# EAGLE design DualLoopingARFG (EAGLE 9.6.0)
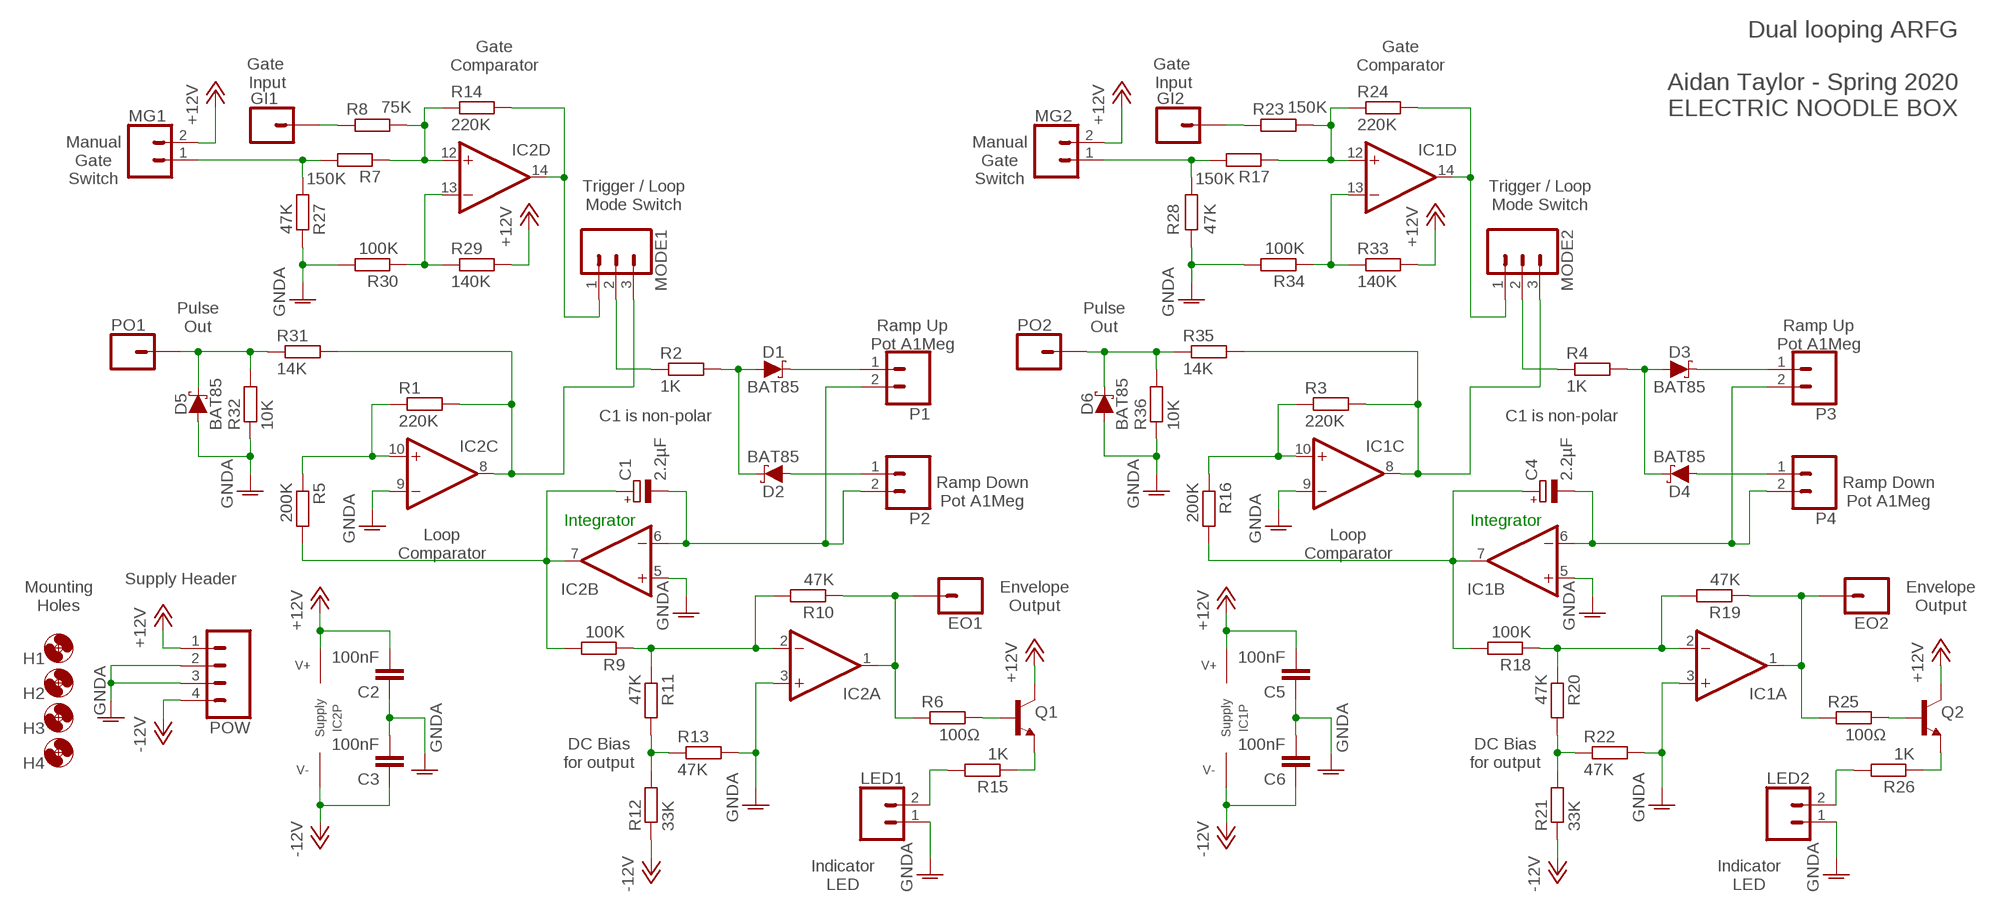
[diagram p0: schematic, sheet 1]

## Parts
C1  2.2µF  CPOL-EUE2-5  [E2-5]
C2  100nF  C-EU050-025X075  [C050-025X075]
C3  100nF  C-EU050-025X075  [C050-025X075]
C4  2.2µF  CPOL-EUE2-5  [E2-5]
C5  100nF  C-EU050-025X075  [C050-025X075]
C6  100nF  C-EU050-025X075  [C050-025X075]
D1  BAT85  SCHOTTKY_DO35  [DO35-7]
D2  BAT85  SCHOTTKY_DO35  [DO35-7]
D3  BAT85  SCHOTTKY_DO35  [DO35-7]
D4  BAT85  SCHOTTKY_DO35  [DO35-7]
D5  BAT85  SCHOTTKY_DO35  [DO35-7]
D6  BAT85  SCHOTTKY_DO35  [DO35-7]
EO1  1XWIREPAD  [1X01]
EO2  1XWIREPAD  [1X01]
GI1  1XWIREPAD  [1X01]
GI2  1XWIREPAD  [1X01]
H1  MOUNT-HOLE3.2  [3,2]
H2  MOUNT-HOLE3.2  [3,2]
H3  MOUNT-HOLE3.2  [3,2]
H4  MOUNT-HOLE3.2  [3,2]
IC1  TL0X4DIL  [DIL14]
IC2  TL0X4DIL  [DIL14]
LED1  2XWIREPAD  [1X02]
LED2  2XWIREPAD  [1X02]
MG1  2XWIREPAD  [1X02]
MG2  2XWIREPAD  [1X02]
MODE1  3XWIREPAD  [1X03]
MODE2  3XWIREPAD  [1X03]
P1  2XWIREPAD  [1X02]
P2  2XWIREPAD  [1X02]
P3  2XWIREPAD  [1X02]
P4  2XWIREPAD  [1X02]
PO1  1XWIREPAD  [1X01]
PO2  1XWIREPAD  [1X01]
POW  4XMOLEX  [MOLEX-1X4]
Q1  2N3904  [TO92]
Q2  2N3904  [TO92]
R1  220K  R-EU_0207/10  [0207/10]
R2  1K  R-EU_0207/10  [0207/10]
R3  220K  R-EU_0207/10  [0207/10]
R4  1K  R-EU_0207/10  [0207/10]
R5  200K  R-EU_0207/10  [0207/10]
R6  100Ω  R-EU_0207/10  [0207/10]
R7  150K  R-EU_0207/10  [0207/10]
R8  75K  R-EU_0207/10  [0207/10]
R9  100K  R-EU_0207/10  [0207/10]
R10  47K  R-EU_0207/10  [0207/10]
R11  47K  R-EU_0207/10  [0207/10]
R12  33K  R-EU_0207/10  [0207/10]
R13  47K  R-EU_0207/10  [0207/10]
R14  220K  R-EU_0207/10  [0207/10]
R15  1K  R-EU_0207/10  [0207/10]
R16  200K  R-EU_0207/10  [0207/10]
R17  150K  R-EU_0207/10  [0207/10]
R18  100K  R-EU_0207/10  [0207/10]
R19  47K  R-EU_0207/10  [0207/10]
R20  47K  R-EU_0207/10  [0207/10]
R21  33K  R-EU_0207/10  [0207/10]
R22  47K  R-EU_0207/10  [0207/10]
R23  150K  R-EU_0207/10  [0207/10]
R24  220K  R-EU_0207/10  [0207/10]
R25  100Ω  R-EU_0207/10  [0207/10]
R26  1K  R-EU_0207/10  [0207/10]
R27  47K  R-EU_0207/10  [0207/10]
R28  47K  R-EU_0207/10  [0207/10]
R29  140K  R-EU_0207/10  [0207/10]
R30  100K  R-EU_0207/10  [0207/10]
R31  14K  R-EU_0207/10  [0207/10]
R32  10K  R-EU_0207/10  [0207/10]
R33  140K  R-EU_0207/10  [0207/10]
R34  100K  R-EU_0207/10  [0207/10]
R35  14K  R-EU_0207/10  [0207/10]
R36  10K  R-EU_0207/10  [0207/10]

## Nets
+12V: C2.2 C5.2 IC1.4(P:V+) IC2.4(P:V+) MG1.2 MG2.2 POW.1 Q1.1(C) Q2.1(C) R29.2 R33.2
-12V: C3.1 C6.1 IC1.11(P:V-) IC2.11(P:V-) POW.4 R12.1 R21.1
ENV1_TRIG: GI1.1 R8.1
ENV1_TRIG1: GI2.1 R23.1
ENVELOPE_OUTPUT: EO1.1 IC2.1(A:OUT) R6.1 R10.1
ENVELOPE_OUTPUT1: EO2.1 IC1.1(A:OUT) R19.1 R25.1
GNDA: C2.1 C3.2 C5.1 C6.2 D5.A D6.A IC1.3(A:+IN) IC1.5(B:+IN) IC1.9(C:-IN) IC2.3(A:+IN) IC2.5(B:+IN) IC2.9(C:-IN) LED1.1 LED2.1 POW.2 POW.3 R13.2 R22.2 R27.2 R28.2 R30.2 R32.1 R34.2 R36.1
N$1: IC2.8(C:OUT) MODE1.3 R1.2 R31.2
N$2: D1.A D2.C R2.2
N$3: D1.C P1.1
N$4: D2.A P2.1
N$5: C1.- IC2.6(B:-IN) P1.2 P2.2
N$6: Q1.2(B) R6.2
N$7: C1.+ IC2.7(B:OUT) R5.2 R9.2
N$8: IC2.10(C:+IN) R1.1 R5.1
N$9: IC2.2(A:-IN) R9.1 R10.2 R11.1
N$10: Q1.3(E) R15.1
N$11: R11.2 R12.2 R13.1
N$12: MG1.1 R7.2 R27.1
N$13: IC2.12(D:+IN) R7.1 R8.2 R14.1
N$14: MODE1.2 R2.1
N$15: IC2.14(D:OUT) MODE1.1 R14.2
N$16: LED1.2 R15.2
N$17: IC1.8(C:OUT) MODE2.3 R3.2 R35.2
N$18: D3.A D4.C R4.2
N$19: D4.A P4.1
N$20: C4.- IC1.6(B:-IN) P3.2 P4.2
N$21: C4.+ IC1.7(B:OUT) R16.2 R18.2
N$22: IC1.10(C:+IN) R3.1 R16.1
N$23: IC1.2(A:-IN) R18.1 R19.2 R20.1
N$24: R20.2 R21.2 R22.1
N$25: MG2.1 R17.2 R28.1
N$26: IC1.12(D:+IN) R17.1 R23.2 R24.1
N$27: IC1.14(D:OUT) MODE2.1 R24.2
N$28: MODE2.2 R4.1
N$29: Q2.2(B) R25.2
N$30: Q2.3(E) R26.1
N$31: LED2.2 R26.2
N$32: D3.C P3.1
N$33: IC2.13(D:-IN) R29.1 R30.1
N$34: D5.C PO1.1 R31.1 R32.2
N$35: IC1.13(D:-IN) R33.1 R34.1
N$36: D6.C PO2.1 R35.1 R36.2

## Notes on the sheet
- Dual looping ARFG
  
  Aidan Taylor - Spring 2020
  ELECTRIC NOODLE BOX
- Gate
  Comparator
- Gate
  Comparator
- Gate 
  Input
- Gate 
  Input
- Manual
  Gate
  Switch
- Manual
  Gate
  Switch
- Trigger / Loop
  Mode Switch
- Trigger / Loop
  Mode Switch
- Pulse
  Out
- Pulse
  Out
- Ramp Up
  Pot A1Meg
- Ramp Up
  Pot A1Meg
- C1 is non-polar | C1 is non-polar
- Ramp Down
  Pot A1Meg
- Ramp Down
  Pot A1Meg
- Integrator | Integrator
- Loop
  Comparator
- Loop
  Comparator
- Supply Header
- Mounting
  Holes
- Envelope
  Output
- Envelope
  Output
- DC Bias
  for output
- DC Bias
  for output
- Indicator
  LED
- Indicator
  LED

## Library data of the parts
C1 C4 = rcl:CPOL-EU: POLARIZED CAPACITOR, European symbol; SPICEPREFIX: C
C2 C3 C5 C6 = rcl:C-EU: CAPACITOR, European symbol; SPICEPREFIX: C
D1-D6 = ElectricNoodleBox:SCHOTTKY_DO35
EO1 EO2 GI1 GI2 PO1 PO2 = ElectricNoodleBox:1XWIREPAD
H1-H4 = holes:MOUNT-HOLE: MOUNTING HOLE with drill center marker
IC1 IC2 = ElectricNoodleBox:TL0X4
LED1 LED2 MG1 MG2 P1-P4 = ElectricNoodleBox:2XWIREPAD
MODE1 MODE2 = ElectricNoodleBox:3XWIREPAD
POW = ElectricNoodleBox:4XMOLEX; SPICEPREFIX: E
Q1 Q2 = transistor:2N3904: NPN TRANSISTOR
R1-R36 = rcl:R-EU_: RESISTOR, European symbol; SPICEPREFIX: R

## Board
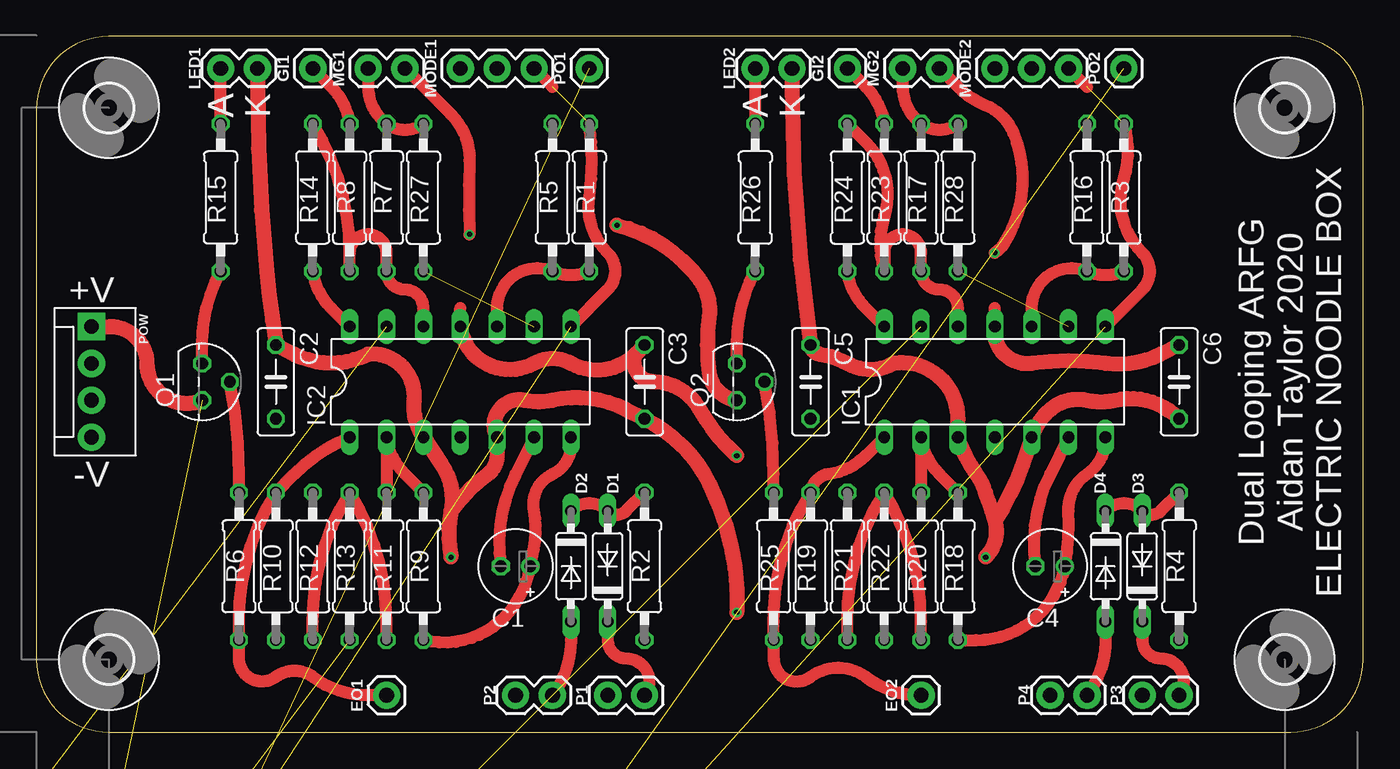
[diagram p1: board, top side]
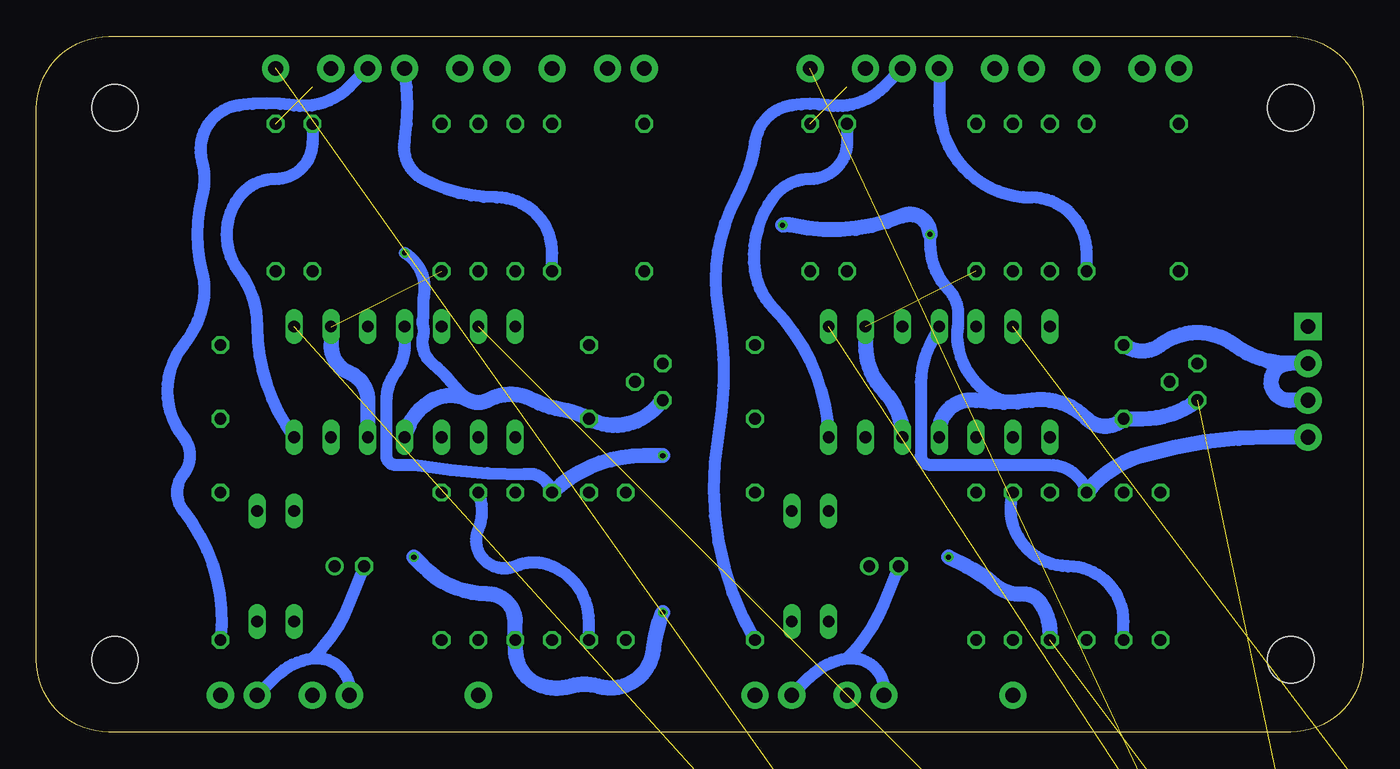
[diagram p2: board, bottom side, seen from below]

Size 91.42 x 47.93 mm. Coordinates in mm from the lower left corner, seen from the top.
Outline: 0,42.93 0,5 arc90 5,0 86.42,0 arc90 91.42,5 91.42,42.93 arc90 86.42,47.93 5,47.93 arc90 0,42.93
Copper layers (1*16): Top 0.035mm / dielectric 1.6mm / Bottom 0.035mm
Design rules "Elecrow_2-layer_PCB_eagle_rule": minimum track width 6mil, minimum drill 12mil, track to track 6mil, track to pad 6mil, pad to pad 6mil, via to via 8mil, smd to smd 0mil, copper to edge 20mil, drill to drill 10mil, minimum pad ring 6mil, minimum via ring 6mil, stop-mask expansion 0mil, vias tented up to drill 100mil, thermal gap 10mil

### Footprints (pad centres in the part's own frame; a part is rotated, then mirrored left to right if it is on the bottom)
E2-5 = drill 0.813 pad 1.27: + -1.016,0 | drill 0.813 pad 1.27 octagon: - 1.016,0
C050-025X075 = drill 0.813 octagon: 1 -2.54,0; 2 2.54,0
DO35-7 = drill 0.813 long: A 3.81,0; C -3.81,0
1X01 = drill 1.016 pad 1.88: 1 0,0
3,2 = hole 3.2: 0,0
DIL14 = drill 0.813 long: 1 -7.62,-3.81; 2 -5.08,-3.81; 3 -2.54,-3.81; 4 0,-3.81; 5 2.54,-3.81; 6 5.08,-3.81; 7 7.62,-3.81; 8 7.62,3.81; 9 5.08,3.81; 10 2.54,3.81; 11 0,3.81; 12 -2.54,3.81; 13 -5.08,3.81; 14 -7.62,3.81
1X02 = drill 1.016 pad 1.88: 1 0,0; 2 2.54,0
1X03 = drill 1.016 pad 1.88: 1 0,0; 2 2.54,0; 3 5.08,0
MOLEX-1X4 = drill 1.016 pad 1.88 square: 1 0,0 | drill 1.016 pad 1.88: 2 2.54,0; 3 5.08,0; 4 7.62,0
TO92 = drill 0.813 octagon: 1 1.27,0; 2 0,1.905; 3 -1.27,0
0207/10 = drill 0.813 octagon: 1 -5.08,0; 2 5.08,0

### Placement (x,y rotation side)
C1  33.02,11.43 180 top
C2  16.51,24.13 270 top
C3  41.91,24.13 270 top
C4  69.85,11.43 180 top
C5  53.34,24.13 270 top
C6  78.74,24.13 270 top
D1  39.37,11.43 90 top
D2  36.83,11.43 270 top
D3  76.2,11.43 90 top
D4  73.66,11.43 270 top
D5  -2,-32 0 top  (outside the outline)
D6  -2,-59 0 top  (outside the outline)
EO1  24.13,2.54 0 top
EO2  60.96,2.54 0 top
GI1  19.05,45.72 0 top
GI2  55.88,45.72 0 top
H1  5,5 0 top
H2  5,43 0 top
H3  86,5 0 top
H4  86,43 0 top
IC1  66.04,24.13 0 top
IC2  29.21,24.13 0 top
LED1  15.24,45.72 180 top
LED2  52.07,45.72 180 top
MG1  22.86,45.72 0 top
MG2  59.69,45.72 0 top
MODE1  29.21,45.72 0 top
MODE2  66.04,45.72 0 top
P1  41.91,2.54 180 top
P2  35.56,2.54 180 top
P3  78.74,2.54 180 top
P4  72.39,2.54 180 top
PO1  38.1,45.72 0 top
PO2  74.93,45.72 0 top
POW  3.81,27.94 270 top
Q1  11.43,24.13 270 top
Q2  48.26,24.13 270 top
R1  38.1,36.83 90 top
R2  41.91,11.43 90 top
R3  74.93,36.83 90 top
R4  78.74,11.43 90 top
R5  35.56,36.83 90 top
R6  13.97,11.43 90 top
R7  24.13,36.83 90 top
R8  21.59,36.83 270 top
R9  26.67,11.43 270 top
R10  16.51,11.43 270 top
R11  24.13,11.43 270 top
R12  19.05,11.43 270 top
R13  21.59,11.43 270 top
R14  19.05,36.83 270 top
R15  12.7,36.83 90 top
R16  72.39,36.83 90 top
R17  60.96,36.83 90 top
R18  63.5,11.43 270 top
R19  53.34,11.43 270 top
R20  60.96,11.43 270 top
R21  55.88,11.43 270 top
R22  58.42,11.43 270 top
R23  58.42,36.83 270 top
R24  55.88,36.83 270 top
R25  50.8,11.43 90 top
R26  49.53,36.83 90 top
R27  26.67,36.83 270 top
R28  63.5,36.83 270 top
R29  -1,-12 0 top  (outside the outline)
R30  -1,-17 0 top  (outside the outline)
R31  -1,-22 0 top  (outside the outline)
R32  -1,-27 0 top  (outside the outline)
R33  -1,-39 0 top  (outside the outline)
R34  -1,-44 0 top  (outside the outline)
R35  -1,-49 0 top  (outside the outline)
R36  -1,-54 0 top  (outside the outline)

### Tracks (layer width: path | path; a pad name or v marks a point on that pad's centre or on a via)
+12V  (via drill 0.35)  (2 unrouted)
  Top 0.813: v29.84,34.29 arc-3 29.84,39.37 arc46 28.57,42.55 MG1.2 | MG2.2 63.5,44.45 arc23 65.41,43.18 arc-45 67.31,41.27 arc-54 66.67,33.66 arc-26 v66.04,33.02
  Top 1.016: POW.1 5.08,27.94 arc-90 7.62,25.4 arc113 Q1.1 | v40.01,34.92 arc-41 45.72,31.11 arc-43 46.35,28.57 arc15 46.35,24.77 arc75 Q2.1
  Bottom 0.813: v29.84,34.29 29.84,33.66 arc-44 28.57,30.48 arc34 27.94,29.21 27.94,27.94 arc-19 27.94,26.67 arc-43 26.04,23.5 arc-53 22.86,22.86 | v66.04,33.02 arc73 64.77,29.84 64.77,28.57 arc-29 64.77,27.94 arc29 64.77,27.3 arc-66 64.14,25.4 arc13 62.87,24.13 arc-13 61.59,22.86
  Bottom 1.016: IC2.4 arc106 26.67,22.86 arc-16 22.86,22.86 arc53 19.05,21.59 arc-90 C2.2 15.24,21.59 arc-37 Q1.1 | Q2.1 48.9,22.23 arc74 C5.2 arc-21 55.24,22.23 arc21 57.15,22.86 arc-57 60.33,22.86 arc57 61.59,22.86 arc-57 64.14,22.86 arc-49 IC1.4 | v29.84,34.29 arc-113 31.75,35.56 arc36 39.37,34.92 arc-26 v40.01,34.92
-12V  (via drill 0.35)
  Top 0.813: IC2.11 29.21,29.21 | IC1.11 66.04,29.21
  Top 1.016: C3.1 41.27,26.04 | 41.27,26.04 arc-74 36.83,25.4 arc57 34.29,25.4 arc-111 IC2.11 | C6.1 77.47,26.04 arc-34 73.66,25.4 arc15 68.58,25.4 arc-105 IC1.11 | v48.26,19.05 47.62,19.68 arc-16 45.72,22.23 arc61 42.55,24.13 arc-111 41.27,26.04
  Bottom 0.813: IC2.11 29.84,26.67 arc-25 30.48,24.13 30.48,19.05 arc-90 29.84,18.41 21.59,18.41 arc74 R12.1 | IC1.11 66.04,26.67 arc37 66.67,24.77 arc-37 67.31,22.86 67.31,19.05 arc-90 66.67,18.41 65.41,18.41 arc-10 57.78,17.78 57.15,17.78 arc57 R21.1
  Bottom 1.016: POW.4 6.35,20.32 arc-16 15.24,19.05 arc-35 R12.1 | v48.26,19.05 49.53,19.05 arc-44 R21.1
ENV1_TRIG
  Top 0.813: GI1.1 20.32,44.45 arc-37 R8.1
ENV1_TRIG1
  Top 0.813: GI2.1 57.15,44.45 arc-37 R23.1
ENVELOPE_OUTPUT
  Top 0.813: IC2.1 arc23 17.78,17.78 R10.1 arc32 13.97,7.62 R6.1 13.97,5.08 arc127 16.51,3.81 arc-74 19.05,3.81 arc37 22.86,2.54 EO1.1
ENVELOPE_OUTPUT1
  Top 0.813: EO2.1 arc-37 57.15,3.81 arc74 53.34,3.81 arc-127 50.8,5.08 R25.1 50.8,7.62 arc-32 R19.1 arc-74 54.61,17.78 arc37 57.15,19.05 IC1.1
GNDA  (via drill 0.35)  (8 unrouted)
  Top 1.016: 28.57,15.24 arc45 27.94,18.41 IC2.3 arc-39 26.04,22.86 arc101 22.86,26.04 arc-53 17.78,26.04 C2.1 arc-3 15.88,31.75 arc-6 15.24,44.45 LED1.1 | 28.57,15.24 arc22 v28.57,12.06 | 28.57,15.24 arc-16 31.11,17.78 arc53 31.75,19.05 IC2.5 arc-131 33.66,22.86 arc25 35.56,22.86 arc-39 40.64,22.23 C3.2 arc-37 46.35,17.14 arc-29 v48.26,8.26 | LED2.1 52.07,44.45 arc8 C5.1 arc74 53.98,26.04 arc-21 55.88,25.4 arc57 59.05,25.4 arc-99 63.5,21.59 IC1.3 arc16 64.77,17.78 arc-16 65.41,16.51 arc0 66.04,14.61 | v65.41,12.06 arc65 66.04,14.61 | 66.04,14.61 arc16 67.94,18.41 IC1.5 arc-31 69.85,22.23 arc-54 72.39,22.86 arc26 74.3,22.86 arc-58 C6.2
  Bottom 1.016: POW.2 5.08,25.4 | 5.08,25.4 arc37 8.89,26.67 arc-74 13.97,26.67 arc74 C2.1 | POW.3 5.08,22.86 arc180 5.08,25.4 | v28.57,12.06 27.3,11.43 arc14 25.4,10.16 arc-45 23.5,9.53 arc61 22.23,8.89 arc38 R13.2 | IC2.9 34.29,26.67 arc-44 33.02,23.5 arc44 IC2.5 | v65.41,12.06 arc3 64.77,11.43 arc-46 60.33,9.53 arc90 58.42,7.62 R22.2 58.42,5.71 arc-74 56.52,3.17 arc-33 54.61,3.17 arc33 52.7,3.17 arc-100 48.9,5.71 arc15 v48.26,8.26 | IC1.9 71.12,26.67 arc-67 69.85,24.77 arc67 68.58,22.86 IC1.5
N$1  (2 unrouted)
  Top 0.813: R1.2 arc-16 38.1,36.83 arc53 39.37,33.02 arc-90 39.37,30.48 IC2.8 | MODE1.3 35.56,44.45
N$2
  Top 0.813: R2.2 40.64,15.24 arc-90 D1.A arc90 D2.C
N$3
  Top 0.813: D1.C 39.37,6.35 arc90 40.64,5.08 arc-127 P1.1
N$4
  Top 0.813: D2.A 36.83,6.35 arc-37 P2.1
N$5
  Top 0.813: IC2.6 33.02,17.78 arc35 C1.-
  Bottom 0.813: P1.2 38.1,3.81 arc37 35.56,5.08 | 35.56,5.08 arc106 P2.2 | C1.- 33.02,8.89 arc24 35.56,5.08
N$6
  Top 0.813: R6.2 13.97,17.78 arc11 Q1.2
N$7
  Top 0.813: IC2.7 arc-76 35.56,17.78 arc76 34.29,15.24 arc-23 34.29,12.7 C1.+ arc-21 33.02,8.89 arc-72 R9.2
  Bottom 0.813: R5.2 35.56,40.64 arc90 38.1,38.1 arc-53 40.64,36.83 arc-46 41.91,31.75 arc-36 40.64,29.21 arc42 IC2.7
N$8
  Top 0.813: IC2.10 31.75,29.21 arc-113 R5.1 arc45 R1.1
N$9
  Top 0.813: R11.1 IC2.2 arc37 25.4,17.78 R9.1
  Bottom 0.813: R10.2 16.51,7.62 arc-90 20.32,11.43 arc106 R11.1
N$10
  Top 0.813: Q1.3 11.43,26.67 arc-28 R15.1
N$11
  Top 0.813: R11.2 24.13,7.62 arc32 R13.1 arc32 19.05,7.62 R12.2
N$12
  Top 0.813: MG1.1 22.86,44.45 arc53 R7.2 arc74 R27.1
N$13
  Top 0.813: R8.2 21.59,33.02 | 21.59,33.02 arc32 R14.1 | 21.59,33.02 arc-90 22.86,34.29 arc-90 24.13,33.02 R7.1 arc90 25.4,30.48 arc-90 26.67,29.21 IC2.12
N$14
  Bottom 0.813: R2.1 arc40 44.45,20.32 arc-20 44.45,29.21 arc39 43.18,36.83 arc-21 41.91,40.64 arc74 39.37,43.18 arc16 36.83,43.18 arc-16 35.56,43.18 arc-37 33.02,44.45 MODE1.2
N$15
  Top 0.813: IC2.14 20.32,29.21 arc-37 R14.2
  Bottom 0.813: R14.2 19.05,33.02 arc-90 22.86,36.83 arc90 29.21,43.18 MODE1.1
N$16
  Top 0.813: R15.2 LED1.2
N$17  (2 unrouted)
  Top 0.813: R3.2 arc-34 74.93,38.1 arc62 76.2,33.02 arc-90 76.2,30.48 IC1.8 | MODE2.3 72.39,44.45
N$18
  Top 0.813: R4.2 77.47,15.24 arc-90 D3.A arc90 D4.C
N$19
  Top 0.813: D4.A 73.66,6.35 arc-37 P4.1
N$20
  Top 0.813: IC1.6 69.85,17.78 arc35 C4.-
  Bottom 0.813: P3.2 74.93,3.81 arc37 72.39,5.08 | 72.39,5.08 arc106 P4.2 | C4.- 69.85,8.89 arc24 72.39,5.08
N$21
  Top 0.813: R18.2 64.77,6.35 arc80 C4.+ arc13 71.12,15.24 arc-59 72.39,17.78 arc59 IC1.7
  Bottom 0.813: R16.2 72.39,40.64 arc90 74.93,38.1 arc-53 77.47,36.83 arc-74 77.47,31.75 arc37 76.2,27.94 arc-37 IC1.7
N$22
  Top 0.813: IC1.10 68.58,29.21 arc-113 R16.1 arc45 R3.1
N$23
  Top 0.813: R20.1 IC1.2 arc37 62.23,17.78 R18.1
  Bottom 0.813: R19.2 53.34,7.62 arc-67 55.88,11.43 arc-45 58.42,11.43 arc135 60.96,13.97 arc-45 R20.1
N$24
  Top 0.813: R20.2 60.96,7.62 arc32 R22.1 arc32 55.88,7.62 R21.2
N$25
  Top 0.813: MG2.1 59.69,44.45 arc53 R17.2 arc74 R28.1
N$26
  Top 0.813: R24.1 57.15,40.64 arc-62 58.42,35.56 arc34 R23.2 58.42,33.02 arc-90 59.69,34.29 arc-90 60.96,33.02 R17.1 arc90 62.23,30.48 arc-90 63.5,29.21 IC1.12
N$27
  Top 0.813: IC1.14 57.15,29.21 arc-37 R24.2
  Bottom 0.813: R24.2 55.88,33.02 arc-90 59.69,36.83 arc28 64.77,38.1 arc71 66.04,40.64 arc-18 MODE2.1
N$28
  Bottom 0.813: R4.1 arc-45 81.28,15.24 arc77 81.28,17.78 arc-77 81.28,20.32 arc77 81.28,26.67 arc-24 80.01,29.21 arc-29 80.01,31.75 arc29 80.01,36.83 arc-29 80.01,39.37 arc96 77.47,43.18 arc16 73.66,43.18 arc-53 69.85,44.45 MODE2.2
N$29
  Top 0.813: R25.2 50.8,17.78 arc11 Q2.2
N$30
  Top 0.813: Q2.3 48.26,26.67 arc-28 R26.1
N$31
  Top 0.813: LED2.2 R26.2
N$32
  Top 0.813: D3.C 76.2,6.35 arc90 77.47,5.08 arc-127 P3.1
N$33  (2 unrouted)
N$34  (3 unrouted)
N$35  (2 unrouted)
N$36  (3 unrouted)

### Text on the board
tPlace: A | A | K | A | K | +V | Dual Looping ARFG / Aidan Taylor 2020 / ELECTRIC NOODLE BOX | -V